# EAGLE design RoverMux (EAGLE 6.4)
DATABASE: /home/mes/eagle/PARTSDB.txt
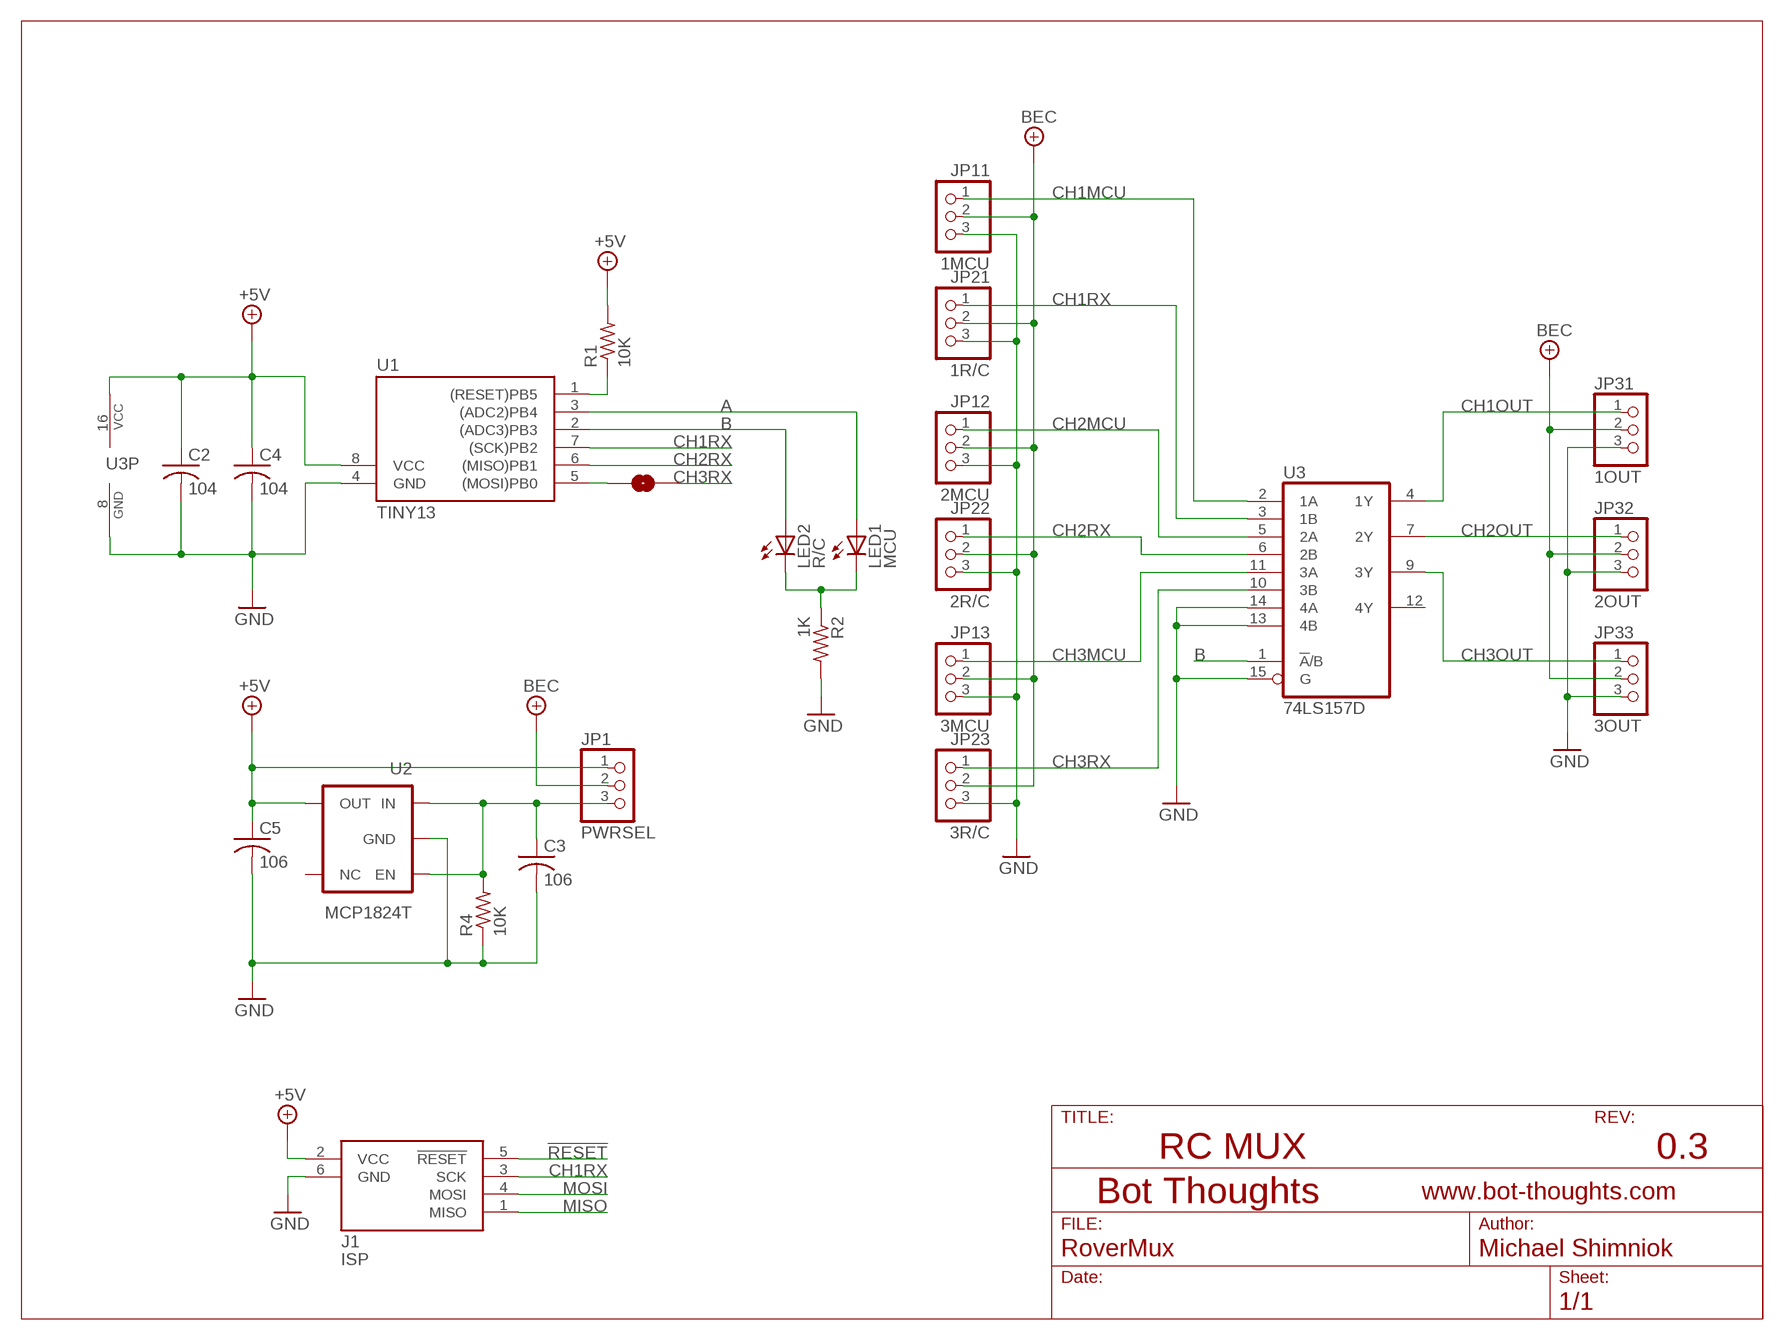
[diagram p0: schematic, sheet 1]

## Parts
C2  104  C-USC0603  [C0603]
C3  106  C-USC0603  [C0603]
C4  104  C-USC0603  [C0603]
C5  106  C-USC0603  [C0603]
J1  ISP  AVRISP6  [CON6P2R]
JP1  PWRSEL  PINHD-1X03_2.00  [1X03M]
JP11  1MCU  PINHD-1X03_2.54-S  [1X03-S]
JP12  2MCU  PINHD-1X03_2.54-S  [1X03-S]
JP13  3MCU  PINHD-1X03_2.54-S  [1X03-S]
JP21  1R/C  PINHD-1X03_2.54-S  [1X03-S]
JP22  2R/C  PINHD-1X03_2.54-S  [1X03-S]
JP23  3R/C  PINHD-1X03_2.54-S  [1X03-S]
JP31  1OUT  PINHD-1X03_2.54-S  [1X03-S]
JP32  2OUT  PINHD-1X03_2.54-S  [1X03-S]
JP33  3OUT  PINHD-1X03_2.54-S  [1X03-S]
LED1  MCU  LEDCHIPLED_1206  [CHIPLED_1206]
LED2  R/C  LEDCHIPLED_1206  [CHIPLED_1206]
R1  10K  R-US_R0603  [R0603]
R2  1K  R-US_R0603  [R0603]
R4  10K  R-US_R0603  [R0603]
SJ1  CH3  SOLDERJUMPERNC2  [SJ_2S-NOTRACE]
U1  TINY13  TINY138S2  [SO08]
U2  MCP1824T  MCP1801  [SOT23-5]
U3  74LS157D  [SO16]

## Nets
!RESET: J1.5(!RESET) R1.1 U1.1((RESET)PB5)
+5V: C2.1 C4.1 C5.1 J1.2(VCC) JP1.1 R1.2 U1.8(VCC) U2.5(OUT) U3.16(VCC)
+7V: JP1.2 JP11.2 JP12.2 JP13.2 JP21.2 JP22.2 JP23.2 JP31.2 JP32.2 JP33.2 ; supply symbol labelled BEC
A: LED1.A U1.3((ADC2)PB4)
B: LED2.A U1.2((ADC3)PB3) U3.1(!A!/B)
CH1MCU: JP11.1 U3.2(1A)
CH1OUT: JP31.1 U3.4(1Y)
CH1RX: J1.3(SCK) JP21.1 U1.7((SCK)PB2) U3.3(1B)
CH2MCU: JP12.1 U3.5(2A)
CH2OUT: JP32.1 U3.7(2Y)
CH2RX: JP22.1 U1.6((MISO)PB1) U3.6(2B)
CH3MCU: JP13.1 U3.11(3A)
CH3OUT: JP33.1 U3.9(3Y)
CH3RX: JP23.1 SJ1.2 U3.10(3B)
GND: C2.2 C3.2 C4.2 C5.2 J1.6(GND) JP11.3 JP12.3 JP13.3 JP21.3 JP22.3 JP23.3 JP31.3 JP32.3 JP33.3 R2.2 R4.1 U1.4(GND) U2.2(GND) U3.8(GND) U3.13(4B) U3.14(4A) U3.15(G)
MISO: J1.1(MISO)
MOSI: J1.4(MOSI) SJ1.1 U1.5((MOSI)PB0)
N$3: LED1.C LED2.C R2.1
REGIN: C3.1 JP1.3 R4.2 U2.1(IN) U2.3(EN)
Unconnected: U2.4(NC) U3.12(4Y)

## Notes on the sheet
- RC MUX | 0.3

## Library data of the parts
C2 C4 = rcl:C-US: CAPACITOR, American symbol; PARTNO: C1608X7R1E104K080AA
C3 C5 = rcl:C-US: CAPACITOR, American symbol; PARTNO: CL10A106MP8NNNC
J1 = bt_avr:AVRISP6: 6-pin dual-row connector for Atmel AVRISP programmer interface
JP1 JP11-JP13 JP21-JP23 JP31-JP33 = pinhead-2:PINHD-1X03: PIN HEADER
LED1 = led:LED: LED OSRAM: - CHIPLED LG R971, LG N971, LY N971, LG Q971, LY Q971, LO R971, LY R971 LH N974, LH R974 LS Q976, LO Q976, LY Q976 LO Q996 - Hyper CHIPLED LW Q18S LB Q993, LB Q99A, LB R99A - SideLED LS A670, LO A670, LY A670, LG A670, LP A670 LB A673, LV A673, LT A673, LW A673 LH A674 LY A675 LS A676, LA A676, LO A676, LY A676, LW A676 LS A679, LY A679, LG A679 - Hyper Micro SIDELED® LS Y876, LA Y876, LO Y876, LY Y876 LT Y87S - SmartLED LW L88C, LW L88S LB L89C, LB L89S, LG L890 LS L89K, LO L89K, LY L89K LS L896, LA L896, LO L896, LY L896 - TOPLED LS T670, LO T670, LY T670, LG T670, LP T670 LSG T670, LSP T670, LSY T670, LOP T670, LYG T670 LG T671, LOG T671, LSG T671 LB T673, LV T673, LT T673, LW T673 LH T674 LS T676, LA T676, LO T676, LY T676, LB T676, LH T676, LSB T676, LW T676 LB T67C, LV T67C, LT T67C, LS T67K, LO T67K, LY T67K, LW E67C LS E67B, LA E67B, LO E67B, LY E67B, LB E67C, LV E67C, LT E67C LW T67C LS T679, LY T679, LG T679 LS T770, LO T770, LY T770, LG T770, LP T770 LB T773, LV T773, LT T773, LW T773 LH T774 LS E675, LA E675, LY E675, LS T675 LS T776, LA T776, LO T776, LY T776, LB T776 LHGB T686 LT T68C, LB T68C - Hyper Mini TOPLED® LB M676 - Mini TOPLED Santana® LG M470 LS M47K, LO M47K, LY M47K Source: http://www.osram.convergy.de LUXEON: - LUMILED® LXK2-PW12-R00, LXK2-PW12-S00, LXK2-PW14-U00, LXK2-PW14-V00 LXK2-PM12-R00, LXK2-PM12-S00, LXK2-PM14-U00 LXK2-PE12-Q00, LXK2-PE12-R00, LXK2-PE12-S00, LXK2-PE14-T00, LXK2-PE14-U00 LXK2-PB12-K00, LXK2-PB12-L00, LXK2-PB12-M00, LXK2-PB14-N00, LXK2-PB14-P00, LXK2-PB14-Q00 LXK2-PR12-L00, LXK2-PR12-M00, LXK2-PR14-Q00, LXK2-PR14-R00 LXK2-PD12-Q00, LXK2-PD12-R00, LXK2-PD12-S00 LXK2-PH12-R00, LXK2-PH12-S00 LXK2-PL12-P00, LXK2-PL12-Q00, LXK2-PL12-R00 Source: www.luxeon.com KINGBRIGHT: KA-3528ASYC Source: www.kingbright.com; PARTNO: LH N974-KN-1
LED2 = led:LED: LED OSRAM: - CHIPLED LG R971, LG N971, LY N971, LG Q971, LY Q971, LO R971, LY R971 LH N974, LH R974 LS Q976, LO Q976, LY Q976 LO Q996 - Hyper CHIPLED LW Q18S LB Q993, LB Q99A, LB R99A - SideLED LS A670, LO A670, LY A670, LG A670, LP A670 LB A673, LV A673, LT A673, LW A673 LH A674 LY A675 LS A676, LA A676, LO A676, LY A676, LW A676 LS A679, LY A679, LG A679 - Hyper Micro SIDELED® LS Y876, LA Y876, LO Y876, LY Y876 LT Y87S - SmartLED LW L88C, LW L88S LB L89C, LB L89S, LG L890 LS L89K, LO L89K, LY L89K LS L896, LA L896, LO L896, LY L896 - TOPLED LS T670, LO T670, LY T670, LG T670, LP T670 LSG T670, LSP T670, LSY T670, LOP T670, LYG T670 LG T671, LOG T671, LSG T671 LB T673, LV T673, LT T673, LW T673 LH T674 LS T676, LA T676, LO T676, LY T676, LB T676, LH T676, LSB T676, LW T676 LB T67C, LV T67C, LT T67C, LS T67K, LO T67K, LY T67K, LW E67C LS E67B, LA E67B, LO E67B, LY E67B, LB E67C, LV E67C, LT E67C LW T67C LS T679, LY T679, LG T679 LS T770, LO T770, LY T770, LG T770, LP T770 LB T773, LV T773, LT T773, LW T773 LH T774 LS E675, LA E675, LY E675, LS T675 LS T776, LA T776, LO T776, LY T776, LB T776 LHGB T686 LT T68C, LB T68C - Hyper Mini TOPLED® LB M676 - Mini TOPLED Santana® LG M470 LS M47K, LO M47K, LY M47K Source: http://www.osram.convergy.de LUXEON: - LUMILED® LXK2-PW12-R00, LXK2-PW12-S00, LXK2-PW14-U00, LXK2-PW14-V00 LXK2-PM12-R00, LXK2-PM12-S00, LXK2-PM14-U00 LXK2-PE12-Q00, LXK2-PE12-R00, LXK2-PE12-S00, LXK2-PE14-T00, LXK2-PE14-U00 LXK2-PB12-K00, LXK2-PB12-L00, LXK2-PB12-M00, LXK2-PB14-N00, LXK2-PB14-P00, LXK2-PB14-Q00 LXK2-PR12-L00, LXK2-PR12-M00, LXK2-PR14-Q00, LXK2-PR14-R00 LXK2-PD12-Q00, LXK2-PD12-R00, LXK2-PD12-S00 LXK2-PH12-R00, LXK2-PH12-S00 LXK2-PL12-P00, LXK2-PL12-Q00, LXK2-PL12-R00 Source: www.luxeon.com KINGBRIGHT: KA-3528ASYC Source: www.kingbright.com; PARTNO: LG N971-KN-1
R1 R4 = rcl:R-US_: RESISTOR, American symbol; PARTNO: 1622829-1
R2 = rcl:R-US_: RESISTOR, American symbol; PARTNO: RC0603JR-07330RL
SJ1 = SparkFun:SOLDERJUMPER: Solder Jumper Standard SMD solder jumper. Used to automate production. Two varients : Normally Open and Normally Closed are the same, but have different paste layers. NC will have a large amount of paste and should jumper during reflow.
U1 = avr-7:TINY13*; PARTNO: ATTINY13A-SSH
U2 = mes_regulators:MCP1801: Microchip MCP1801 LDO Regulator The MCP1801 is a family of CMOS low dropout (LDO) voltage regulators that can deliver up to 150 mA of current while consuming only 25 μA of quiescent current (typical) with input operating range from 2.0V to 10.0V. Datasheet.pdf <http://ww1.microchip.com/downloads/en/DeviceDoc/22051D.pdf>; PARTNO: MCP1824T-5002E/OT
U3 = 74xx-us:74*157: Quadruple 2-line to 1-line data SELECTOR/MULTIPLEXER; PARTNO: 74HCT157D,652

## Board
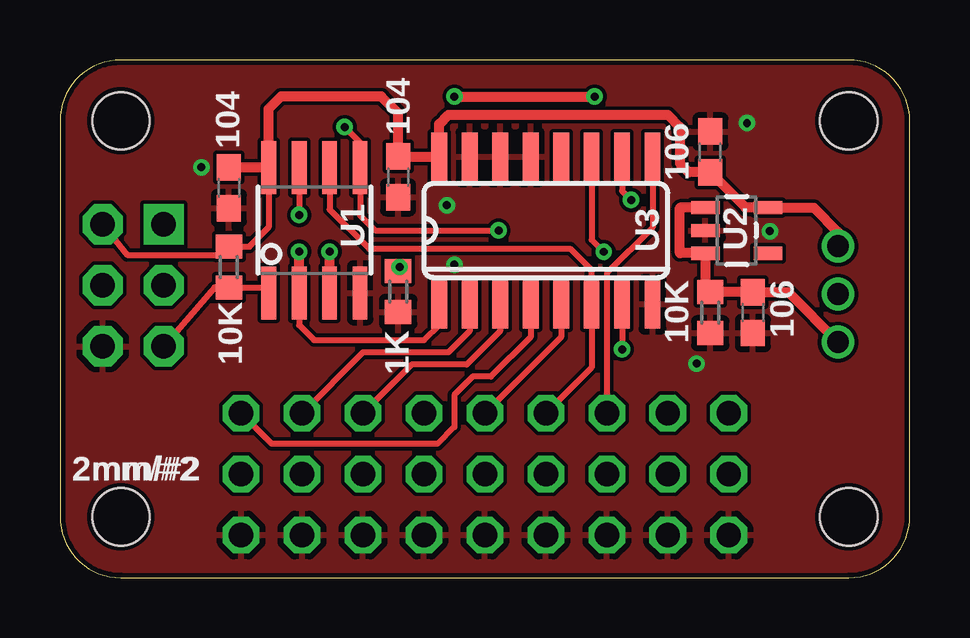
[diagram p1: board, top side]
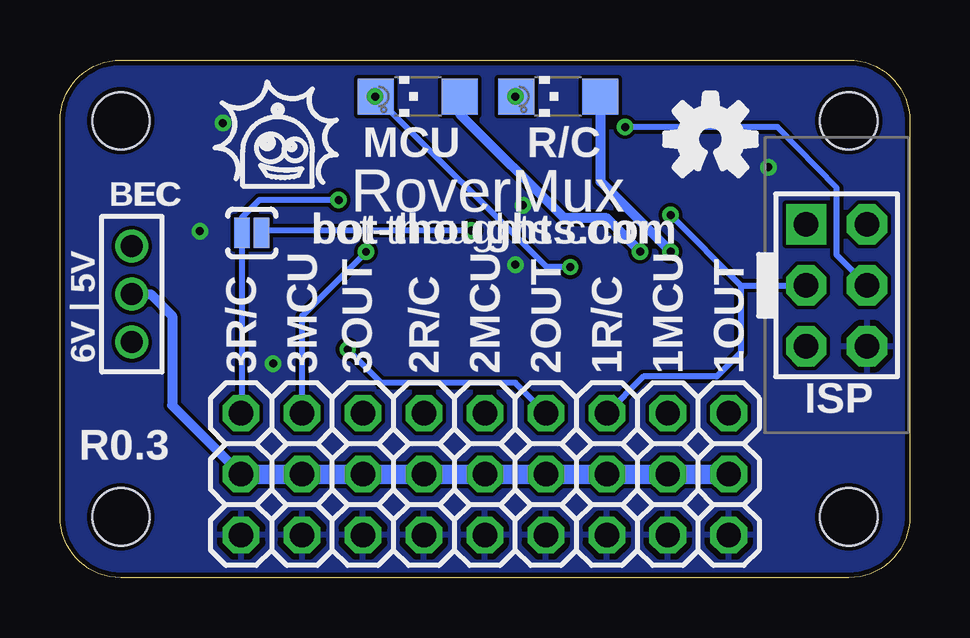
[diagram p2: board, bottom side, seen from below]

Size 35.41 x 21.59 mm. Coordinates in mm from the lower left corner, seen from the top.
Outline: 32.87,21.59 2.54,21.59 arc90 0,19.05 0,2.54 arc90 2.54,0 32.87,0 arc90 35.41,2.54 35.41,19.05 arc90 32.87,21.59
Copper layers (1*16): Top 0.0356mm / dielectric 1.5011mm / Bottom 0.0356mm
Design rules "LaenPCBOrder *": minimum track width 6mil, minimum drill 13mil, track to track 6mil, track to pad 6mil, pad to pad 6mil, via to via 6mil, smd to smd 6mil, copper to edge 8mil, drill to drill 6mil, minimum pad ring 7mil, minimum via ring 7mil, stop-mask expansion 4mil, vias tented up to drill 20mil, thermal gap 10mil
Holes 2.39 mm at 32.87,2.54 32.87,19.05 2.54,2.54 2.54,19.05

### Footprints (pad centres in the part's own frame; a part is rotated, then mirrored left to right if it is on the bottom)
C0603 = smd 1.1 x 1: 1 -0.85,0; 2 0.85,0
CON6P2R = drill 1.016 pad 1.676 square: 1 -2.54,-1.27 | drill 1.016 pad 1.676 octagon: 2 -2.54,1.27; 3 0,-1.27; 4 0,1.27; 5 2.54,-1.27; 6 2.54,1.27
1X03M = drill 0.914: 1 -2,0; 2 0,0; 3 2,0
1X03-S = drill 1.016 octagon: 1 -2.54,0; 2 0,0; 3 2.54,0
CHIPLED_1206 = smd 1.5 x 1.5: A 0,-1.75; C 0,1.75
R0603 = smd 1 x 1.1: 1 -0.85,0; 2 0.85,0
SJ_2S-NOTRACE = smd 0.635 x 1.27: 1 -0.401,0; 2 0.413,0
SO08 = smd 0.61 x 2.21: 1 -1.905,-2.616; 2 -0.635,-2.616; 3 0.635,-2.616; 4 1.905,-2.616; 5 1.905,2.616; 6 0.635,2.616; 7 -0.635,2.616; 8 -1.905,2.616
SOT23-5 = smd 0.55 x 1.2: 1 -0.95,-1.3; 2 0,-1.3; 3 0.95,-1.3; 4 0.95,1.3; 5 -0.95,1.3
SO16 = smd 0.66 x 2.032: 1 -4.445,-3.073; 2 -3.175,-3.073; 3 -1.905,-3.073; 4 -0.635,-3.073; 5 0.635,-3.073; 6 1.905,-3.073; 7 3.175,-3.073; 8 4.445,-3.073; 9 4.445,3.073; 10 3.175,3.073; 11 1.905,3.073; 12 0.635,3.073; 13 -0.635,3.073; 14 -1.905,3.073; 15 -3.175,3.073; 16 -4.445,3.073

### Placement (x,y rotation side)
C2  7.04,16.26 270 top
C3  28.87,11.05 270 top
C4  14.09,16.71 270 top
C5  27.09,17.75 90 top
J1  3.05,12.19 270 bottom
JP1  32.42,11.82 270 bottom
JP11  10.08,4.32 270 bottom
JP12  17.7,4.32 270 bottom
JP13  25.32,4.32 270 bottom
JP21  12.62,4.32 270 bottom
JP22  20.24,4.32 270 bottom
JP23  27.86,4.32 270 bottom
JP31  7.54,4.32 270 bottom
JP32  15.16,4.32 270 bottom
JP33  22.78,4.32 270 bottom
LED1  20.5,20.07 90 bottom
LED2  14.66,20.07 90 bottom
R1  7.04,12.95 90 top
R2  14.09,11.93 270 top
R4  27.1,11.05 90 top
SJ1  27.42,14.37 180 bottom
U1  10.6,14.49 0 top
U2  28.2,14.48 270 top
U3  20.24,14.48 0 top

### Tracks (layer width: path | path; a pad name or v marks a point on that pad's centre or on a via)
!RESET
  Top 0.254: U1.1 8.42,12.1 R1.1 6.44,12.1 J1.5
+5V
  Top 0.254: J1.2 2.79,13.46 6.62,13.46 R1.2 7.89,13.8 8.7,14.62 U1.8 | C2.1
  Top 0.406: C2.1 U1.8 8.7,19.56 9.21,20.07 13.39,20.07 14.09,19.36 C4.1 15.79,17.56 U3.16 15.8,18.92 16.18,19.3 25.32,19.3 25.83,18.8 25.83,17.27 26.2,16.9 C5.1 28.57,15.43 U2.5 31.41,15.43 32.42,14.42 JP1.1
+7V
  Bottom 0.406: JP1.2 31.64,11.82 30.73,10.92 30.73,7.19 JP23.2
  Bottom 0.813: JP23.2 JP13.2 JP33.2 JP22.2 JP12.2 JP32.2 JP21.2 JP11.2 JP31.2
A  (via drill 0.33)
  Top 0.406: U1.3 v11.24,13.6
  Bottom 0.406: LED1.A 18.75,19.33 14.4,14.99 12.62,14.99 v11.24,13.6
B  (via drill 0.33)
  Top 0.254: U1.2 9.97,10.53 10.59,9.91 15.16,9.91 15.8,10.54 U3.1
  Top 0.406: U1.2 v9.97,13.6
  Bottom 0.406: v9.97,13.6 12.88,16.51 12.88,20.04 LED2.A
CH1MCU
  Top 0.254: U3.2 17.07,10.29 16.18,9.4 12.62,9.4 JP11.1
CH1OUT
  Top 0.254: U3.4 19.61,10.03 17.96,8.38 17.2,8.38 16.43,7.62 16.43,6.29 15.73,5.59 8.81,5.59 JP31.1
CH1RX  (via drill 0.33)
  Top 0.254: U3.3 18.34,10.29 16.94,8.89 14.66,8.89 JP21.1 | U1.7 v9.97,15.12
  Bottom 0.254: v9.97,15.12 7.04,12.19 | 7.04,12.19 J1.3 | 7.04,12.19 7.04,9.4 8.05,8.38 11.1,8.38 JP21.1
CH2MCU
  Top 0.254: U3.5 20.88,10.03 JP12.1
CH2OUT  (via drill 0.33)
  Top 0.254: U3.7 v23.42,9.53
  Bottom 0.254: JP32.1 16.43,8.13 22.02,8.13 v23.42,9.53
CH2RX
  Top 0.254: JP22.1 22.15,8.76 U3.6 22.15,12.83 21.26,13.72 12.88,13.72 11.24,15.36 U1.6
CH3MCU  (via drill 0.33)
  Top 0.254: U3.11 22.15,14.1 v22.66,13.59
  Bottom 0.254: JP13.1 25.32,10.92 v22.66,13.59
CH3OUT
  Top 0.254: U3.9 24.69,14.61 22.78,12.7 JP33.1
CH3RX  (via drill 0.33)
  Top 0.254: U3.10 23.42,16.13 v23.8,15.75
  Bottom 0.254: v23.8,15.75 27.1,15.75 27.83,15.02 SJ1.2 27.83,6.89 JP23.1
GND  (via drill 0.33)
  other vias: 16.12,15.53 16.43,13.06 29.58,14.45 28.63,18.96 26.53,8.93 5.89,17.12
  pour Top: 2.54,21.59 32.87,21.59 arc-90 35.41,19.05 35.41,2.54 arc-90 32.87,0 2.54,0 arc-90 0,2.54 0,19.05 arc-90
  pour Bottom: 2.54,21.59 32.87,21.59 arc-90 35.41,19.05 35.41,2.54 arc-90 32.87,0 2.54,0 arc-90 0,2.54 0,19.05 arc-90
MOSI  (via drill 0.33)
  Top 0.254: v18.27,14.48 13.13,14.48 12.51,15.1 U1.5 12.51,18.15 v11.86,18.8
  Bottom 0.254: v18.27,14.48 26.91,14.48 SJ1.1 | J1.4 3.05,13.46 3.05,16.26 5.51,18.8 v11.86,18.8
N$3  (via drill 0.33)
  Top 0.254: R2.1 13.97,12.78 v14.15,12.95
  Top 0.406: v16.43,20.07 v22.28,20.07
  Bottom 0.254: v14.15,12.95 15.14,12.95 LED1.C
  Bottom 0.406: v22.28,20.07 LED1.C | LED2.C v16.43,20.07
REGIN
  Top 0.406: U2.1 25.83,15.43 25.83,13.53 U2.3 26.9,11.85 R4.2 C3.1 30.34,11.9 JP1.3

### Text on the board
tPlace: 2mm/#2
bPlace: BEC | 6V | 5V
bNames: RoverMux | bot-thoughts.com | R0.3
tsilk: 104 | 104 | 106 | U1 | U3 | U2 | 10K | 106 | 1K | 10K | 2mm/#2
bsilk: R/C | MCU | RoverMux | BEC | bot-thoughts.com | 1OUT | 1MCU | 1R/C | 2OUT | 2MCU | 2R/C | 3OUT | 3MCU | 3R/C | 6V | 5V | ISP | R0.3